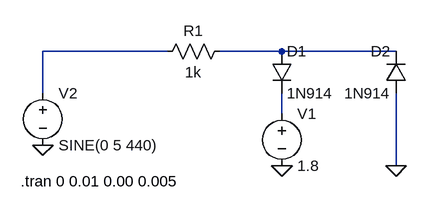
[diagram p0: schematic Chopper.asc]
Chopper.asc, the LTspice schematic file:
Version 4
SHEET 1 880 680
WIRE 240 64 48 64
WIRE 416 64 320 64
WIRE 592 64 416 64
WIRE 48 128 48 64
WIRE 416 160 416 128
WIRE 592 240 592 128
FLAG 48 208 0
FLAG 416 240 0
FLAG 592 240 0
SYMBOL voltage 416 144 R0
WINDOW 123 0 0 Left 0
WINDOW 39 0 0 Left 0
SYMATTR InstName V1
SYMATTR Value 1.8
SYMBOL voltage 48 112 R0
WINDOW 123 0 0 Left 0
WINDOW 39 0 0 Left 0
SYMATTR InstName V2
SYMATTR Value SINE(0 5 440)
SYMBOL res 336 48 R90
WINDOW 0 0 56 VBottom 2
WINDOW 3 32 56 VTop 2
SYMATTR InstName R1
SYMATTR Value 1k
SYMBOL diode 400 64 R0
SYMATTR InstName D1
SYMATTR Value 1N914
SYMBOL diode 608 128 R180
WINDOW 0 24 64 Left 2
WINDOW 3 24 0 Left 2
SYMATTR InstName D2
SYMATTR Value 1N914
TEXT 14 264 Left 2 !.tran 0 0.01 0.00 0.005

The netlist it stands for:
* Chopper.asc
V1 N003 0 1.8
V2 N001 0 SINE(0 5 440)
R1 N002 N001 1k
D1 N002 N003 1N914
D2 0 N002 1N914
.model D D
.lib standard.dio
.tran 0 0.01 0.00 0.005
.backanno
.end